# EAGLE design board (EAGLE 9.1.0)
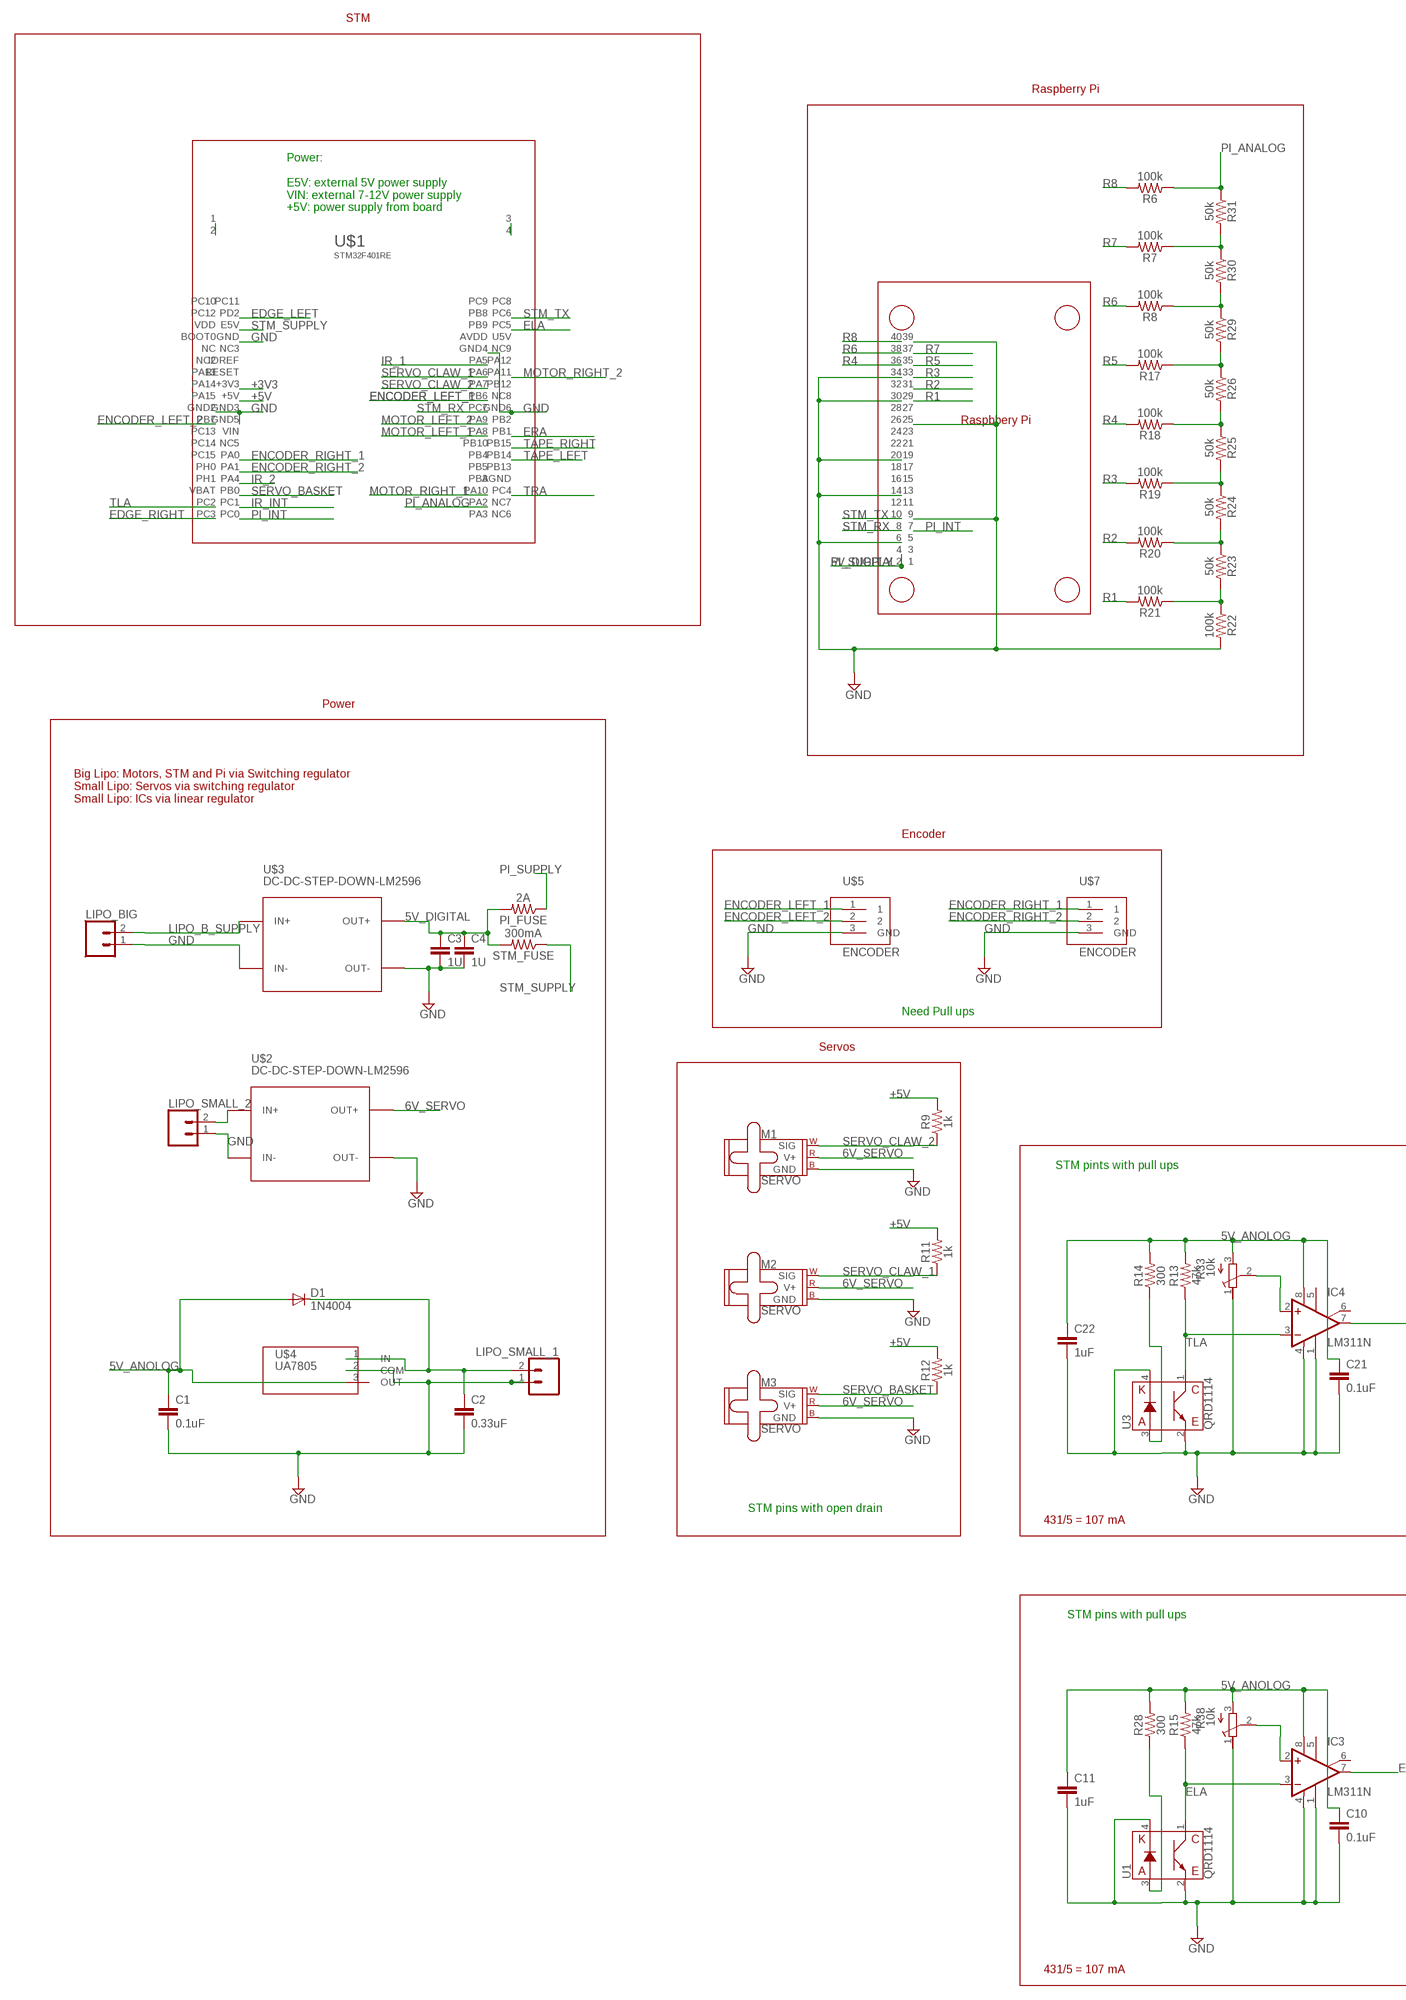
[diagram p0: schematic, sheet 1, part 1 of 2]
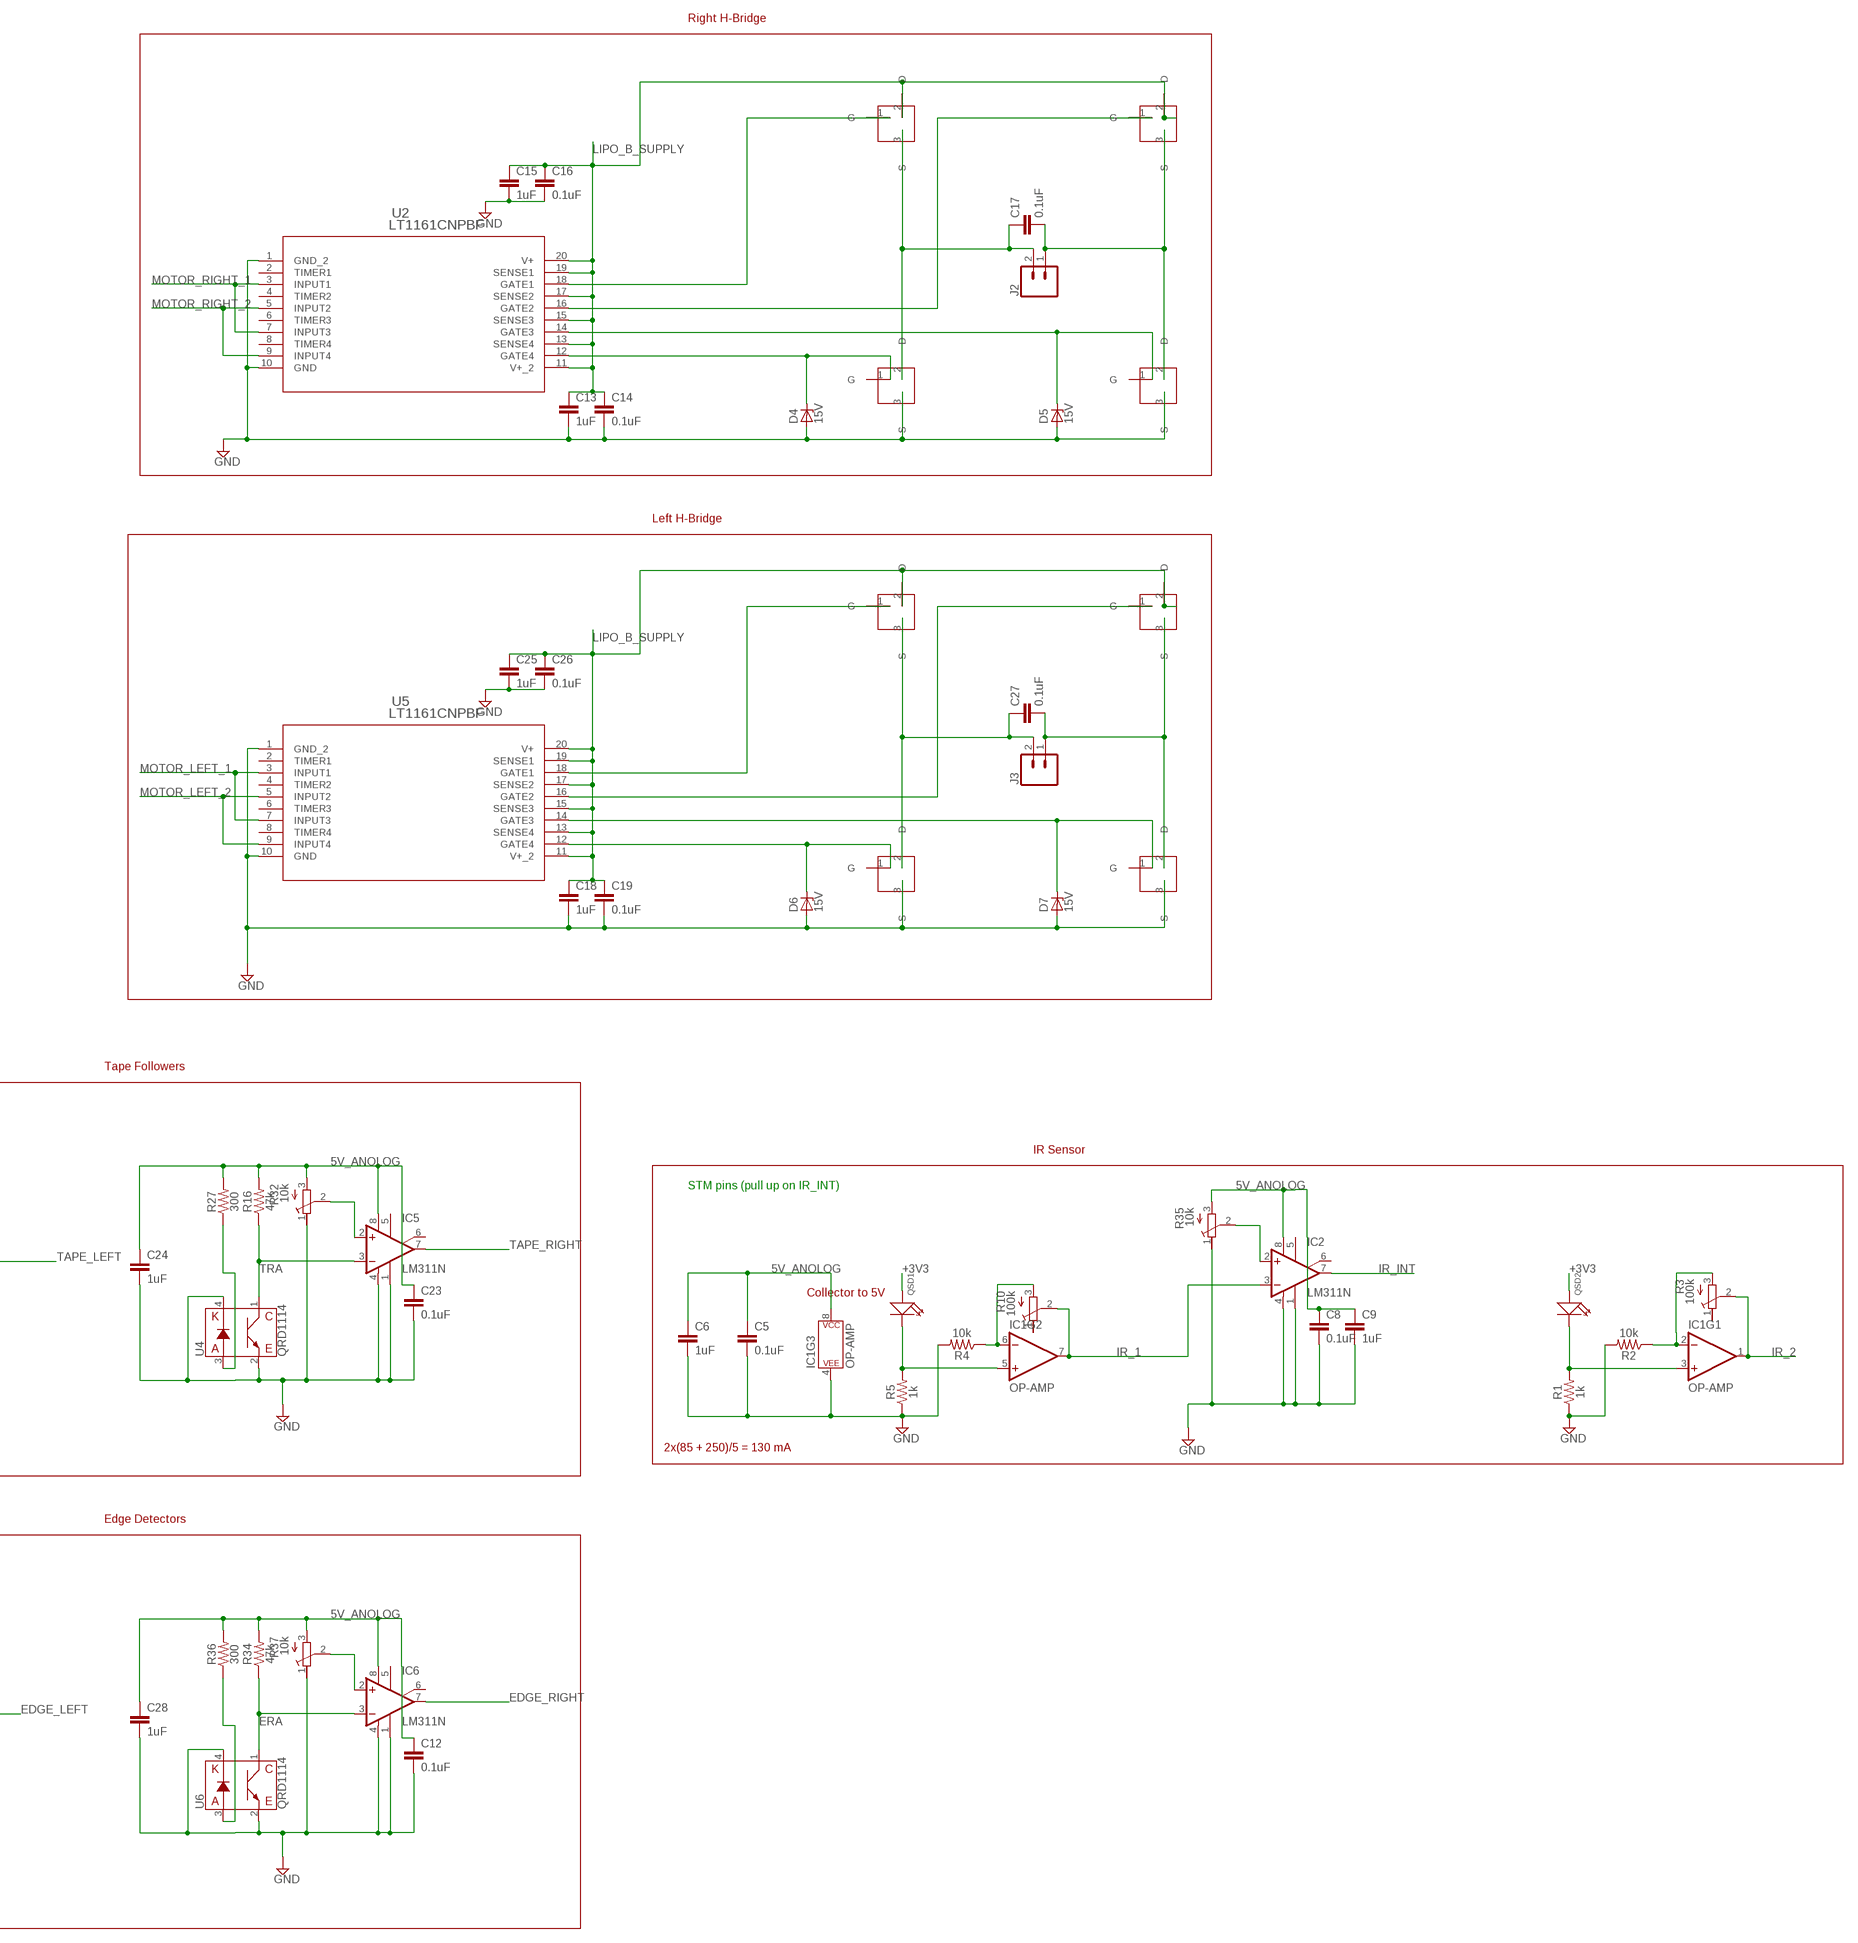
[diagram p1: schematic, sheet 1, part 2 of 2]

## Parts
C1  0.1uF  0.1UF-KIT-EZ-50V-20%  [CAP-PTH-SMALL-KIT]
C2  0.33uF  0.1UF-KIT-EZ-50V-20%  [CAP-PTH-SMALL-KIT]
C3  1U  C5/5  [C5B5]
C4  1U  C5/5  [C5B5]
C5  0.1uF  0.1UF-KIT-EZ-50V-20%  [CAP-PTH-SMALL-KIT]
C6  1uF  0.1UF-KIT-EZ-50V-20%  [CAP-PTH-SMALL-KIT]
C8  0.1uF  0.1UF-KIT-EZ-50V-20%  [CAP-PTH-SMALL-KIT]
C9  1uF  0.1UF-KIT-EZ-50V-20%  [CAP-PTH-SMALL-KIT]
C10  0.1uF  0.1UF-KIT-EZ-50V-20%  [CAP-PTH-SMALL-KIT]
C11  1uF  0.1UF-KIT-EZ-50V-20%  [CAP-PTH-SMALL-KIT]
C12  0.1uF  0.1UF-KIT-EZ-50V-20%  [CAP-PTH-SMALL-KIT]
C13  1uF  0.1UF-KIT-EZ-50V-20%  [CAP-PTH-SMALL-KIT]
C14  0.1uF  0.1UF-KIT-EZ-50V-20%  [CAP-PTH-SMALL-KIT]
C15  1uF  0.1UF-KIT-EZ-50V-20%  [CAP-PTH-SMALL-KIT]
C16  0.1uF  0.1UF-KIT-EZ-50V-20%  [CAP-PTH-SMALL-KIT]
C17  0.1uF  0.1UF-KIT-EZ-50V-20%  [CAP-PTH-SMALL-KIT]
C18  1uF  0.1UF-KIT-EZ-50V-20%  [CAP-PTH-SMALL-KIT]
C19  0.1uF  0.1UF-KIT-EZ-50V-20%  [CAP-PTH-SMALL-KIT]
C21  0.1uF  0.1UF-KIT-EZ-50V-20%  [CAP-PTH-SMALL-KIT]
C22  1uF  0.1UF-KIT-EZ-50V-20%  [CAP-PTH-SMALL-KIT]
C23  0.1uF  0.1UF-KIT-EZ-50V-20%  [CAP-PTH-SMALL-KIT]
C24  1uF  0.1UF-KIT-EZ-50V-20%  [CAP-PTH-SMALL-KIT]
C25  1uF  0.1UF-KIT-EZ-50V-20%  [CAP-PTH-SMALL-KIT]
C26  0.1uF  0.1UF-KIT-EZ-50V-20%  [CAP-PTH-SMALL-KIT]
C27  0.1uF  0.1UF-KIT-EZ-50V-20%  [CAP-PTH-SMALL-KIT]
C28  1uF  0.1UF-KIT-EZ-50V-20%  [CAP-PTH-SMALL-KIT]
D1  1N4004  [DO41-10]
D4  15V  ZENER-DIODEDO41Z10  [DO41Z10]
D5  15V  ZENER-DIODEDO41Z10  [DO41Z10]
D6  15V  ZENER-DIODEDO41Z10  [DO41Z10]
D7  15V  ZENER-DIODEDO41Z10  [DO41Z10]
IC1  OP-AMP  OPAMP-DUALDIP  [DIP08]
IC2  LM311N  [DIL08]
IC3  LM311N  [DIL08]
IC4  LM311N  [DIL08]
IC5  LM311N  [DIL08]
IC6  LM311N  [DIL08]
J2  CONN_02  [1X02]
J3  CONN_02  [1X02]
LIPO_BIG  CONN_02  [1X02]
LIPO_SMALL_1  CONN_02  [1X02]
LIPO_SMALL_2  CONN_02  [1X02]
M1  SERVO  [1X03]
M2  SERVO  [1X03]
M3  SERVO  [1X03]
PI_FUSE  2A  1KOHM-HORIZ-1/4W-5%  [AXIAL-0.3]
QSD1  DIP-LED-GREEN-GREEN(2P-D5MM)  [LED2-2.54-D5.0MM]
QSD2  DIP-LED-GREEN-GREEN(2P-D5MM)  [LED2-2.54-D5.0MM]
R1  1k  1KOHM-HORIZ-1/4W-5%  [AXIAL-0.3]
R2  10k  10KOHM-HORIZ-1/4W-1%  [AXIAL-0.3]
R3  100k  R-TRIMMT93YA  [RTRIMT93YA]
R4  10k  10KOHM-HORIZ-1/4W-1%  [AXIAL-0.3]
R5  1k  1KOHM-HORIZ-1/4W-5%  [AXIAL-0.3]
R6  100k  1KOHM-HORIZ-1/4W-1%  [AXIAL-0.3]
R7  100k  1KOHM-HORIZ-1/4W-1%  [AXIAL-0.3]
R8  100k  1KOHM-HORIZ-1/4W-1%  [AXIAL-0.3]
R9  1k  1KOHM-HORIZ-1/4W-5%  [AXIAL-0.3]
R10  100k  R-TRIMMT93YA  [RTRIMT93YA]
R11  1k  1KOHM-HORIZ-1/4W-5%  [AXIAL-0.3]
R12  1k  1KOHM-HORIZ-1/4W-5%  [AXIAL-0.3]
R13  47k  1KOHM-HORIZ-1/4W-1%  [AXIAL-0.3]
R14  300  1KOHM-HORIZ-1/4W-1%  [AXIAL-0.3]
R15  47k  1KOHM-HORIZ-1/4W-1%  [AXIAL-0.3]
R16  47k  1KOHM-HORIZ-1/4W-1%  [AXIAL-0.3]
R17  100k  1KOHM-HORIZ-1/4W-1%  [AXIAL-0.3]
R18  100k  1KOHM-HORIZ-1/4W-1%  [AXIAL-0.3]
R19  100k  1KOHM-HORIZ-1/4W-1%  [AXIAL-0.3]
R20  100k  1KOHM-HORIZ-1/4W-1%  [AXIAL-0.3]
R21  100k  1KOHM-HORIZ-1/4W-1%  [AXIAL-0.3]
R22  100k  1KOHM-HORIZ-1/4W-1%  [AXIAL-0.3]
R23  50k  1KOHM-HORIZ-1/4W-1%  [AXIAL-0.3]
R24  50k  1KOHM-HORIZ-1/4W-1%  [AXIAL-0.3]
R25  50k  1KOHM-HORIZ-1/4W-1%  [AXIAL-0.3]
R26  50k  1KOHM-HORIZ-1/4W-1%  [AXIAL-0.3]
R27  300  1KOHM-HORIZ-1/4W-1%  [AXIAL-0.3]
R28  300  1KOHM-HORIZ-1/4W-1%  [AXIAL-0.3]
R29  50k  1KOHM-HORIZ-1/4W-1%  [AXIAL-0.3]
R30  50k  1KOHM-HORIZ-1/4W-1%  [AXIAL-0.3]
R31  50k  1KOHM-HORIZ-1/4W-1%  [AXIAL-0.3]
R32  10k  R-TRIMMT93YA  [RTRIMT93YA]
R33  10k  R-TRIMMT93YA  [RTRIMT93YA]
R34  47k  1KOHM-HORIZ-1/4W-1%  [AXIAL-0.3]
R35  10k  R-TRIMMT93YA  [RTRIMT93YA]
R36  300  1KOHM-HORIZ-1/4W-1%  [AXIAL-0.3]
R37  10k  R-TRIMMT93YA  [RTRIMT93YA]
R38  10k  R-TRIMMT93YA  [RTRIMT93YA]
STM_FUSE  300mA  1KOHM-HORIZ-1/4W-5%  [AXIAL-0.3]
U1  QRD1114  [QRD1114]
U2  LT1161CNPBF  [PDIP-20_N]
U3  QRD1114  [QRD1114]
U4  QRD1114  [QRD1114]
U5  LT1161CNPBF  [PDIP-20_N]
U6  QRD1114  [QRD1114]
U$1  STM32F401RE  [STM32]
U$2  DC-DC-STEP-DOWN-LM2596  [DC-DC-STEP-DOWN-LM2596]
U$3  DC-DC-STEP-DOWN-LM2596  [DC-DC-STEP-DOWN-LM2596]
U$4  UA7805  [TO-220AB]
U$5  ENCODER  [TO-220AB]
U$6  RPI3  [PI]
U$7  ENCODER  [TO-220AB]
U$11  HUF75321  [TO-220AB]
U$12  HUF75321  [TO-220AB]
U$13  HUF75321  [TO-220AB]
U$14  HUF75321  [TO-220AB]
U$15  HUF75321  [TO-220AB]
U$16  HUF75321  [TO-220AB]
U$17  HUF75321  [TO-220AB]
U$18  HUF75321  [TO-220AB]

## Nets
5V_ANOLOG: C1.1 C5.1 C6.1 C8.1 C9.1 C10.1 C11.1 C12.1 C21.1 C22.1 C23.1 C24.1 C28.1 D1.A IC1.8(P$V+) IC2.8(V+) IC3.8(V+) IC4.8(V+) IC5.8(V+) IC6.8(V+) R13.P$2 R14.P$2 R15.P$2 R16.P$2 R27.P$2 R28.P$2 R32.3(A) R33.3(A) R34.P$2 R35.3(A) R36.P$2 R37.3(A) R38.3(A) U$4.3(OUT)
5V_DIGITAL: C3.1 C4.1 PI_FUSE.P$2 STM_FUSE.P$2 U$3.OUT+ U$6.2 U$6.4
6V_SERVO: M1.2(V+) M2.2(V+) M3.2(V+) U$2.OUT+
+3V3: QSD1.+ QSD2.+ U$1.+3V3
+5V: R9.P$2 R11.P$2 R12.P$2 U$1.+5V
EDGE_LEFT: IC3.7(OUT) U$1.PD2
EDGE_RIGHT: IC6.7(OUT) U$1.PC3
ELA: IC3.3(-IN) R15.P$1 U1.1(C) U$1.PC5
ENCODER_LEFT_1: U$1.PB6 U$5.1
ENCODER_LEFT_2: U$1.PB7 U$5.2
ENCODER_RIGHT_1: U$1.PA0 U$7.1
ENCODER_RIGHT_2: U$1.PA1 U$7.2
ERA: IC6.3(-IN) R34.P$1 U6.1(C) U$1.PB1
GND: C1.2 C2.2 C3.2 C4.2 C5.2 C6.2 C8.2 C9.2 C10.2 C11.2 C12.2 C13.2 C14.2 C15.2 C16.2 C18.2 C19.2 C21.2 C22.2 C23.2 C24.2 C25.2 C26.2 C28.2 D4.A D5.A D6.A D7.A IC1.4(P$V-) IC2.1(GND) IC2.4(V-) IC3.1(GND) IC3.4(V-) IC4.1(GND) IC4.4(V-) IC5.1(GND) IC5.4(V-) IC6.1(GND) IC6.4(V-) LIPO_BIG.1 LIPO_SMALL_1.1 LIPO_SMALL_2.1 M1.3(GND) M2.3(GND) M3.3(GND) R1.P$1 R2.P$2 R4.P$2 R5.P$1 R22.P$2 R32.1(E) R33.1(E) R35.1(E) R37.1(E) R38.1(E) U1.2(E) U1.4(K) U2.1(GND_2) U2.10(GND) U3.2(E) U3.4(K) U4.2(E) U4.4(K) U5.1(GND_2) U5.10(GND) U6.2(E) U6.4(K) U$1.GND U$1.GND2 U$1.GND3 U$1.GND4 U$1.GND5 U$1.GND6 U$2.IN- U$2.OUT- U$3.IN- U$3.OUT- U$4.2(COM) U$5.3(GND) U$6.6 U$6.9 U$6.14 U$6.20 U$6.25 U$6.30 U$6.34 U$6.39 U$7.3(GND) U$13.3(S) U$14.3(S) U$17.3(S) U$18.3(S)
IR_1: IC1.7(OUT) IC2.3(-IN) R10.2(S) U$1.PA5
IR_2: IC1.1(OUT) R3.2(S) U$1.PA4
IR_INT: IC2.7(OUT) U$1.PC1
LIPO_B_SUPPLY: C13.1 C14.1 C15.1 C16.1 C18.1 C19.1 C25.1 C26.1 LIPO_BIG.2 U2.11(V+_2) U2.13(SENSE4) U2.15(SENSE3) U2.17(SENSE2) U2.19(SENSE1) U2.20(V+) U5.11(V+_2) U5.13(SENSE4) U5.15(SENSE3) U5.17(SENSE2) U5.19(SENSE1) U5.20(V+) U$3.IN+ U$11.2(D) U$12.2(D) U$15.2(D) U$16.2(D)
MOTOR_LEFT_1: U5.3(INPUT1) U5.7(INPUT3) U$1.PA8
MOTOR_LEFT_2: U5.5(INPUT2) U5.9(INPUT4) U$1.PA9
MOTOR_RIGHT_1: U2.3(INPUT1) U2.7(INPUT3) U$1.PA10
MOTOR_RIGHT_2: U2.5(INPUT2) U2.9(INPUT4) U$1.PA11
N$1: LIPO_SMALL_2.2 U$2.IN+
N$2: IC1.2(-IN) R2.P$1 R3.3(A)
N$3: R28.P$1 U1.3(A)
N$4: IC1.6(-IN) R4.P$1 R10.3(A)
N$5: R21.P$1 R22.P$1 R23.P$2
N$6: IC5.2(+IN) R32.2(S)
N$7: R20.P$1 R23.P$1 R24.P$2
N$8: R19.P$1 R24.P$1 R25.P$2
N$9: R18.P$1 R25.P$1 R26.P$2
N$10: R17.P$1 R26.P$1 R29.P$2
N$11: R8.P$1 R29.P$1 R30.P$2
N$12: R7.P$1 R30.P$1 R31.P$2
N$13: IC2.2(+IN) R35.2(S)
N$15: IC3.2(+IN) R38.2(S)
N$16: R14.P$1 U3.3(A)
N$17: R36.P$1 U6.3(A)
N$19: IC6.2(+IN) R37.2(S)
N$20: U2.18(GATE1) U$11.1(G)
N$21: U2.16(GATE2) U$12.1(G)
N$22: D5.C U2.14(GATE3) U$14.1(G)
N$23: D4.C U2.12(GATE4) U$13.1(G)
N$24: C17.2 J2.1 U$12.3(S) U$14.2(D)
N$25: C17.1 J2.2 U$11.3(S) U$13.2(D)
N$26: U5.18(GATE1) U$15.1(G)
N$27: U5.16(GATE2) U$16.1(G)
N$29: IC4.2(+IN) R33.2(S)
N$30: R27.P$1 U4.3(A)
N$32: U$1.1 U$1.2
N$33: D7.C U5.14(GATE3) U$18.1(G)
N$34: D6.C U5.12(GATE4) U$17.1(G)
N$35: C27.2 J3.1 U$16.3(S) U$18.2(D)
N$36: C27.1 J3.2 U$15.3(S) U$17.2(D)
N$37: U$1.3 U$1.4
OUTPUT1: IC1.5(+IN) QSD1.- R5.P$2
OUTPUT2: IC1.3(+IN) QSD2.- R1.P$2
PI_ANALOG: R6.P$1 R31.P$1 U$1.PA2
PI_INT: U$1.PC0 U$6.7
PI_SUPPLY: PI_FUSE.P$1 U$6.2 U$6.4
R1: R21.P$2 U$6.29
R2: R20.P$2 U$6.31
R3: R19.P$2 U$6.33
R4: R18.P$2 U$6.36
R5: R17.P$2 U$6.35
R6: R8.P$2 U$6.38
R7: R7.P$2 U$6.37
R8: R6.P$2 U$6.40
SERVO_BASKET: M3.1(SIG) R12.P$1 U$1.PB0
SERVO_CLAW_1: M2.1(SIG) R11.P$1 U$1.PA6
SERVO_CLAW_2: M1.1(SIG) R9.P$1 U$1.PA7
STM_RX: U$1.PC7 U$6.8
STM_SUPPLY: STM_FUSE.P$1 U$1.E5V
STM_TX: U$1.PC6 U$6.10
TAPE_LEFT: IC4.7(OUT) U$1.PB14
TAPE_RIGHT: IC5.7(OUT) U$1.PB15
TLA: IC4.3(-IN) R13.P$1 U3.1(C) U$1.PC2
TRA: IC5.3(-IN) R16.P$1 U4.1(C) U$1.PC4
V_IN1: C2.1 D1.C LIPO_SMALL_1.2 U$4.1(IN)
Unconnected: IC2.5(ON) IC2.6(ON/STR) IC3.5(ON) IC3.6(ON/STR) IC4.5(ON) IC4.6(ON/STR) IC5.5(ON) IC5.6(ON/STR) IC6.5(ON) IC6.6(ON/STR) R3.1(E) R10.1(E) U2.2(TIMER1) U2.4(TIMER2) U2.6(TIMER3) U2.8(TIMER4) U5.2(TIMER1) U5.4(TIMER2) U5.6(TIMER3) U5.8(TIMER4) U$1.AGND U$1.AVDD U$1.BOOT0 U$1.IOREF U$1.NC U$1.NC2 U$1.NC3 U$1.NC5 U$1.NC6 U$1.NC7 U$1.NC8 U$1.NC9 U$1.PA3 U$1.PA12 U$1.PA13 U$1.PA14 U$1.PA15 U$1.PB2 U$1.PB3 U$1.PB4 U$1.PB5 U$1.PB8 U$1.PB9 U$1.PB10 U$1.PB12 U$1.PB13 U$1.PC8 U$1.PC9 U$1.PC10 U$1.PC11 U$1.PC12 U$1.PC13 U$1.PC14 U$1.PC15 U$1.PH0 U$1.PH1 U$1.RESET U$1.U5V U$1.VBAT U$1.VDD U$1.VIN U$6.1 U$6.3 U$6.5 U$6.11 U$6.12 U$6.13 U$6.15 U$6.16 U$6.17 U$6.18 U$6.19 U$6.21 U$6.22 U$6.23 U$6.24 U$6.26 U$6.27 U$6.28 U$6.32

## Notes on the sheet
- STM
- Raspberry Pi | Right H-Bridge
- Power:
  
  E5V: external 5V power supply
  VIN: external 7-12V power supply
  +5V: power supply from board
- Left H-Bridge
- Power
- Big Lipo: Motors, STM and Pi via Switching regulator
  Small Lipo: Servos via switching regulator
  Small Lipo: ICs via linear regulator
- Encoder
- Need Pull ups
- Servos
- Tape Followers
- STM pints with pull ups
- IR Sensor
- STM pins (pull up on IR_INT)
- Collector to 5V
- STM pins with open drain | 2x(85 + 250)/5 = 130 mA
- 431/5 = 107 mA
- Edge Detectors
- STM pins with pull ups
- 431/5 = 107 mA

## Library data of the parts
C1 C5 C8 C10 C12 C14 C16 C17 C19 C21 C23 C26 C27 = SparkFun-Capacitors:0.1UF: 0.1µF ceramic capacitors A capacitor is a passive two-terminal electrical component used to store electrical energy temporarily in an electric field.; PROD_ID: CAP-08370
C2 C6 C9 C11 C13 C15 C18 C22 C24 C25 C28 = SparkFun-Capacitors:0.1UF: 0.1µF ceramic capacitors A capacitor is a passive two-terminal electrical component used to store electrical energy temporarily in an electric field.; PROD_ID: CAP-08370; VALUE: 0.1uF
C3 C4 = capacitor-wima:C: CAPACITOR naming: grid - package width
D1 = adafruit:1N4004: DIODE General purpose 1N400x type rectifier (With bigger pads) http://www.ladyada.net/library/pcb/eaglelibrary.html
D4-D7 = diode:ZENER-DIODE: Z-Diode
IC1 = SparkFun-IC-Amplifiers:OPAMP-DUAL: Generic op-amp footprint This component is for the standard 358 pinning of a dual op-amp From the LM358 datasheet: Pin 1: Output A Pin 2: Inverting Input A Pin 3: Non-Inverting Input A Pin 4: Gnd Pin 5: Non-Inverting Input B Pin 6: Inverting Input B Pin 7: Output B Pin 8: V+; PROD_ID: NA-XXXXX
IC2-IC6 = linear:LM311: COMPARATOR
J2 J3 LIPO_BIG LIPO_SMALL_1 LIPO_SMALL_2 = SparkFun-Connectors:CONN_02: Multi connection point. Often used as Generic Header-pin footprint for 0.1 inch spaced/style header connections On any of the 0.1 inch spaced packages, you can populate with these: Break Away Headers - Straight <https://www.sparkfun.com/products/116> (PRT-00116) Break Away Male Headers - Right Angle <https://www.sparkfun.com/products/553> (PRT-00553) Female Headers <https://www.sparkfun.com/products/115> (PRT-00115) Break Away Headers - Machine Pin <https://www.sparkfun.com/products/117> (PRT-00117) Break Away Female Headers - Swiss Machine Pin <https://www.sparkfun.com/products/743> (PRT-00743) For SCREWTERMINALS and SPRING TERMINALS visit here: Screw Terimnals on SparkFun.com <https://www.sparkfun.com/search/results?term=Screw+Terminals> (5mm/3.5mm/2.54mm spacing) This device is also useful as a general connection point to wire up your design to another part of your project. Our various solder wires solder well into these plated through hole pads. Hook-Up Wire - Assortment (Stranded, 22 AWG) <https://www.sparkfun.com/products/11375> (PRT-11375) Hook-Up Wire - Assortment (Solid Core, 22 AWG) <https://www.sparkfun.com/products/11367> (PRT-11367) View the entire wire category on our website here <https://www.sparkfun.com/categories/141> Special notes: Molex polarized connector foot print use with: PRT-08233 with associated crimp pins and housings. 2.54_SCREWTERM for use with PRT-10571. 3.5mm Screw Terminal footprints for PRT-08084 5mm Screw Terminal footprints for use with PRT-08432
M1-M3 = SparkFun-Electromechanical:SERVO: Servo Motor 3-pin connector for a standard servo motor (voltage supply, ground, and control signal.) SparkFun Products Servo - Generic (Sub-Micro Size) <https://www.sparkfun.com/products/9065> (ROB-09065) Servo - Generic High Torque Continuous Rotation (Standard Size) <https://www.sparkfun.com/products/9347> (ROB-09347) Servo - Generic High Torque (Standard Size) <https://www.sparkfun.com/products/11965> (ROB-11965)
PI_FUSE STM_FUSE = SparkFun-Resistors:1KOHM: 1kΩ resistor A resistor is a passive two-terminal electrical component that implements electrical resistance as a circuit element. Resistors act to reduce current flow, and, at the same time, act to lower voltage levels within circuits. - Wikipedia; PROD_ID: RES-08380; VALUE: 1k
QSD1 QSD2 = Seeed-LED:DIP-LED-GREEN-GREEN(2P-D5MM): 304090038; MPN: G502DC; VALUE: G502DC
R1 R5 R9 R11 R12 = SparkFun-Resistors:1KOHM: 1kΩ resistor A resistor is a passive two-terminal electrical component that implements electrical resistance as a circuit element. Resistors act to reduce current flow, and, at the same time, act to lower voltage levels within circuits. - Wikipedia; PROD_ID: RES-08380
R2 R4 = SparkFun-Resistors:10KOHM: 10kΩ resistor A resistor is a passive two-terminal electrical component that implements electrical resistance as a circuit element. Resistors act to reduce current flow, and, at the same time, act to lower voltage levels within circuits. - Wikipedia; PROD_ID: RES-12183
R3 R10 R32 R33 R35 R37 R38 = resistor:R-TRIMM: Trimm resistor
R6-R8 R13-R31 R34 R36 = SparkFun-Resistors:1KOHM: 1kΩ resistor A resistor is a passive two-terminal electrical component that implements electrical resistance as a circuit element. Resistors act to reduce current flow, and, at the same time, act to lower voltage levels within circuits. - Wikipedia; PROD_ID: RES-12182; VALUE: 1k
U1 U3 U4 U6 = SparkFun-Sensors:QRD1114: QRD1114 Reflective Proximity, Object Sensor This sensor uses an infrared emitted diode combined with an infrared phototransistor to detect the reflected infrared signal. Ideal for sensing black-to-white transitions or can be used to detect nearby objects (.5-1cm). Datasheet <http://www.sparkfun.com/datasheets/BOT/QRD1114.pdf> SparkFun Products Optical Detector / Phototransistor - QRD1114 <https://www.sparkfun.com/products/246> (SEN-00246); PROD_ID: IC-09032; SF_ID: SEN-00246
U2 U5 = LT1161NC:LT1161CNPBF; MANUFACTURER_PART_NUMBER: LT1161CN#PBF; VENDOR: Linear Technology
U$1 = stm32f401re:STM32F401RE
U$2 U$3 = diy-modules:DC-DC-STEP-DOWN-LM2596: DC/DC Step-Down Regulator based on LM2596-ADJ chip LM2596 datasheet available here: http://www.ti.com/lit/ds/symlink/lm2596.pdf Click here to find device on ebay.com <http://www.ebay.com/sch/lm2596+power+regulator>
U$4 = TO220:UA7805
U$5 U$7 = TO220:ENCODER
U$6 = Raspberry_Pi_3:RPI3
U$11-U$18 = TO220:HUF75321

## Board
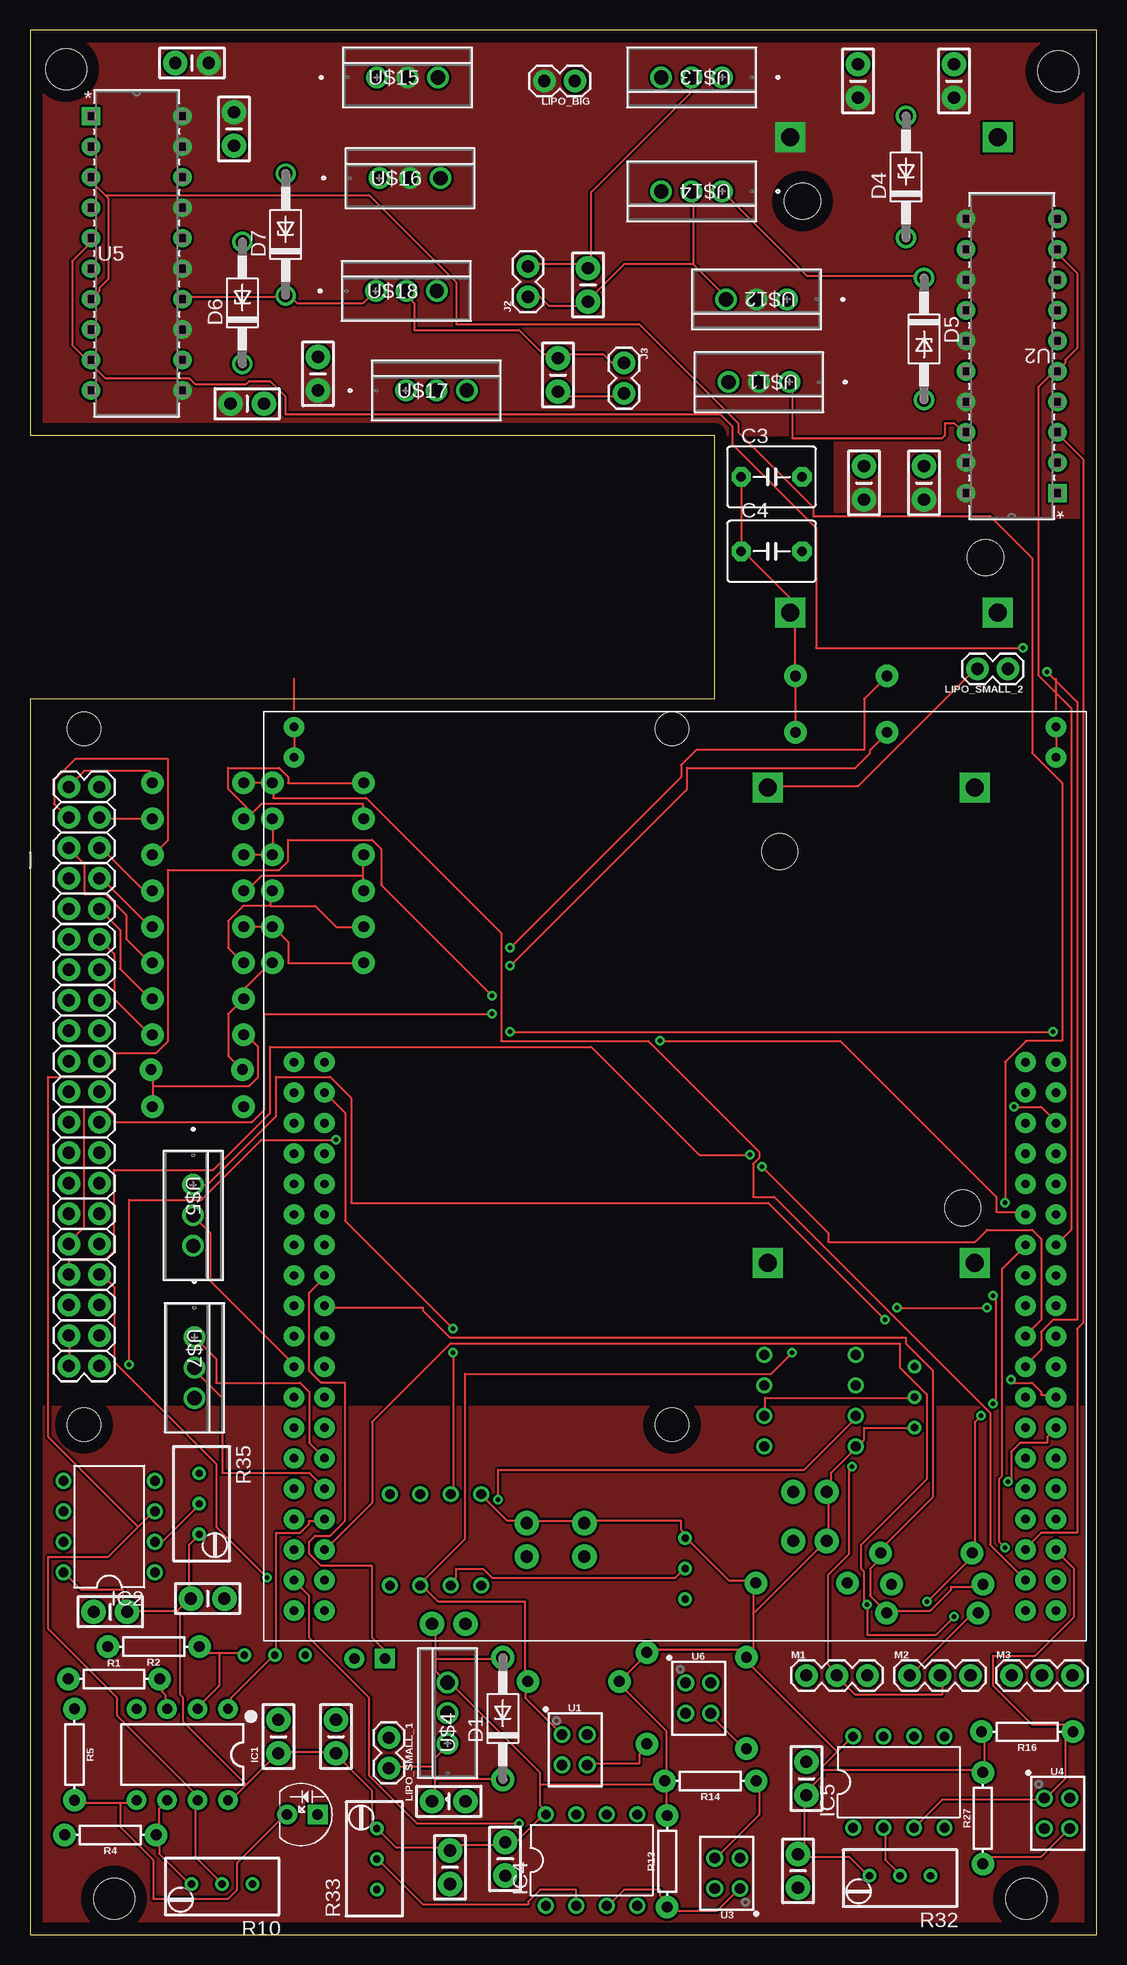
[diagram p2: board, top side]
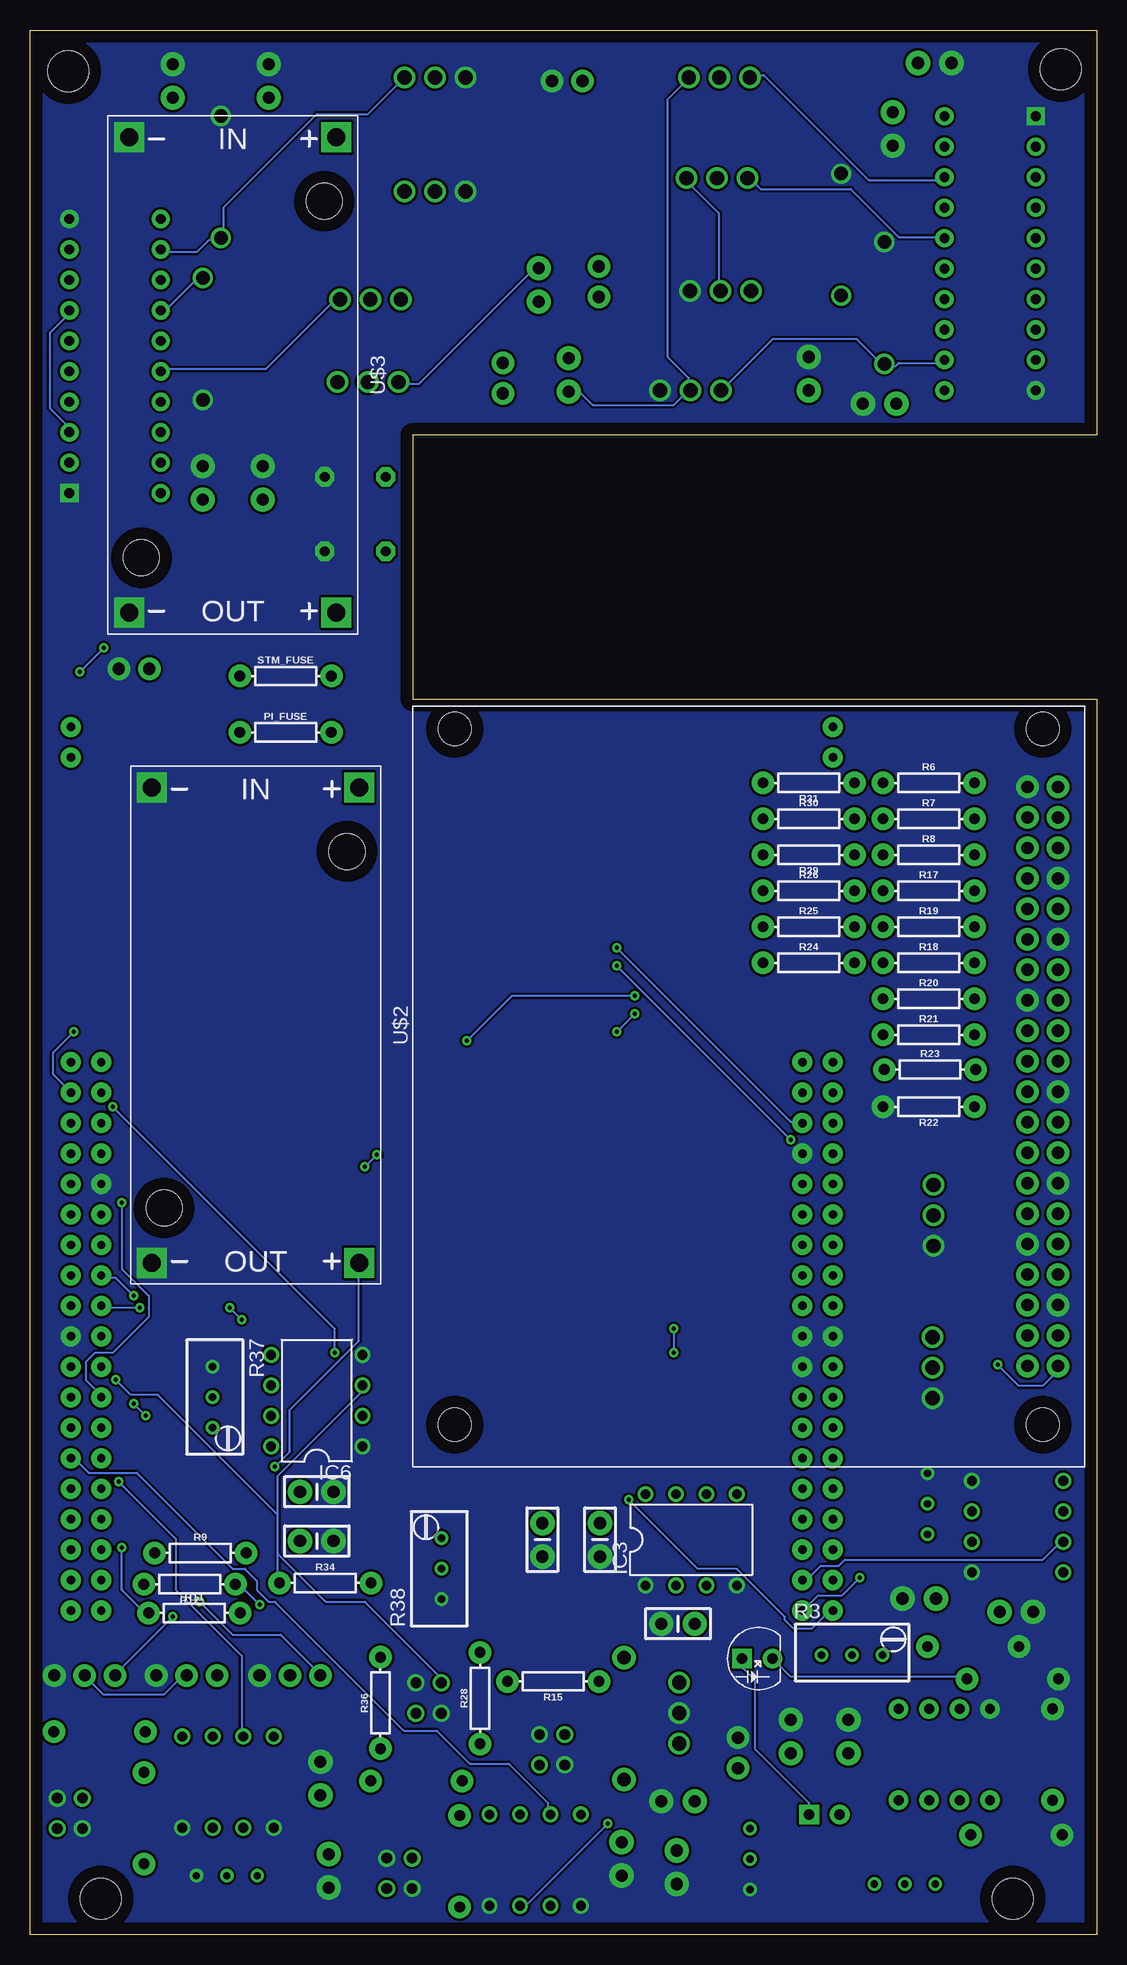
[diagram p3: board, bottom side, seen from below]

Size 88.9 x 158.75 mm. Coordinates in mm from the lower left corner, seen from the top.
Outline: 0,0 88.9,0 88.9,158.75 0,158.75 0,125 57,125 57,103 0,103 0,0
Copper layers (1*16): Top 0.05mm / dielectric 1.5mm / Bottom 0.05mm
Design rules "default *": minimum track width 6mil, minimum drill 0.35mm, track to track 8mil, track to pad 8mil, pad to pad 8mil, via to via 8mil, smd to smd 8mil, copper to edge 40mil, drill to drill 6mil, minimum pad ring 10mil, minimum via ring 8mil, stop-mask expansion 4mil, vias tented up to drill 0mil, thermal gap 10mil
Holes 3.4 mm at 3,155.5 85.7,155.3 83,3 7,3

### Footprints (pad centres in the part's own frame; a part is rotated, then mirrored left to right if it is on the bottom)
CAP-PTH-SMALL-KIT = drill 1.016 pad 2.032: 1 -1.397,0; 2 1.397,0
C5B5 = drill 0.813 pad 1.6 octagon: 1 -2.54,0; 2 2.54,0
DO41-10 = drill 1.118 pad 1.93: A 5.08,0; C -5.08,0
DO41Z10 = drill 1.118: A 5.08,0; C -5.08,0
DIP08 = drill 0.813 pad 1.626: 1 -3.81,-3.81; 2 -1.27,-3.81; 3 1.27,-3.81; 4 3.81,-3.81; 5 3.81,3.81; 6 1.27,3.81; 7 -1.27,3.81; 8 -3.81,3.81
DIL08 = drill 0.813 pad 1.27: 1 -3.81,-3.81; 2 -1.27,-3.81; 3 1.27,-3.81; 4 3.81,-3.81; 5 3.81,3.81; 6 1.27,3.81; 7 -1.27,3.81; 8 -3.81,3.81
1X02 = drill 1.016 pad 1.88: 1 0,0; 2 2.54,0
1X03 = drill 1.016 pad 1.88: 1 0,0; 2 2.54,0; 3 5.08,0
AXIAL-0.3 = drill 0.9 pad 1.88: P$1 -3.81,0; P$2 3.81,0
LED2-2.54-D5.0MM = drill 0.889 pad 1.651 square: + -1.27,0 | drill 0.889 pad 1.651: - 1.27,0
RTRIMT93YA = drill 0.61: 1 0,-2.54; 2 0,0; 3 0,2.54
QRD1114 = drill 0.9: 1 -1.067,1.27; 2 -1.067,-1.27; 3 1.041,-1.27; 4 1.041,1.27
PDIP-20_N = drill 0.813 pad 1.524 square: 1 -7.62,22.86 | drill 0.813 pad 1.524: 2 -7.62,20.32; 3 -7.62,17.78; 4 -7.62,15.24; 5 -7.62,12.7; 6 -7.62,10.16; 7 -7.62,7.62; 8 -7.62,5.08; 9 -7.62,2.54; 10 -7.62,0; 11 0,0; 12 0,2.54; 13 0,5.08; 14 0,7.62; 15 0,10.16; 16 0,12.7; 17 0,15.24; 18 0,17.78; 19 0,20.32; 20 0,22.86
STM32 = drill 0.7 pad 1.676: 1 0,73.66; 2 0,71.12; 3 63.5,73.66; 4 63.5,71.12; +3V3 2.54,27.94; +5V 2.54,25.4; AGND 63.5,7.62; AVDD 60.96,38.1; BOOT0 0,38.1; E5V 2.54,40.64; GND 2.54,38.1; GND2 0,22.86; GND3 2.54,22.86; GND4 60.96,35.56; GND5 2.54,20.32; GND6 63.5,22.86; IOREF 2.54,33.02; NC 0,35.56; NC2 0,33.02; NC3 2.54,35.56; NC5 2.54,15.24; NC6 63.5,0; NC7 63.5,2.54; NC8 63.5,25.4; NC9 63.5,35.56; PA0 2.54,12.7; PA1 2.54,10.16; PA2 60.96,2.54; PA3 60.96,0; PA4 2.54,7.62; PA5 60.96,33.02; PA6 60.96,30.48; PA7 60.96,27.94; PA8 60.96,17.78; PA9 60.96,20.32; PA10 60.96,5.08; PA11 63.5,30.48; PA12 63.5,33.02; PA13 0,30.48; PA14 0,27.94; PA15 0,25.4; PB0 2.54,5.08; PB1 63.5,17.78; PB2 63.5,20.32; PB3 60.96,7.62; PB4 60.96,12.7; PB5 60.96,10.16; PB6 60.96,25.4; PB7 0,20.32; PB8 60.96,43.18; PB9 60.96,40.64; PB10 60.96,15.24; PB12 63.5,27.94; PB13 63.5,10.16; PB14 63.5,12.7; PB15 63.5,15.24; PC0 2.54,0; PC1 2.54,2.54; PC2 0,2.54; PC3 0,0; PC4 63.5,5.08; PC5 63.5,40.64; PC6 63.5,43.18; PC7 60.96,22.86; PC8 63.5,45.72; PC9 60.96,45.72; PC10 0,45.72; PC11 2.54,45.72; PC12 0,43.18; PC13 0,17.78; PC14 0,15.24; PC15 0,12.7; PD2 2.54,43.18; PH0 0,10.16; PH1 0,7.62; RESET 2.54,30.48; U5V 63.5,38.1; VBAT 0,5.08; VDD 0,40.64; VIN 2.54,17.78
DC-DC-STEP-DOWN-LM2596 = drill 1.5 pad 2.5 square: IN+ -19.812,8.636; IN- -19.812,-8.636; OUT+ 19.812,8.636; OUT- 19.812,-8.636 | hole 3: -14.478,7.62; 15.24,-7.62
TO-220AB = drill 1.194 pad 1.702: 1 -5.08,0; 2 -2.54,0; 3 0,0
PI = drill 1.016 pad 1.88: 1 8.39,51.22; 2 8.39,53.76; 3 10.93,51.22; 4 10.93,53.76; 5 13.47,51.22; 6 13.47,53.76; 7 16.01,51.22; 8 16.01,53.76; 9 18.55,51.22; 10 18.55,53.76; 11 21.09,51.22; 12 21.09,53.76; 13 23.63,51.22; 14 23.63,53.76; 15 26.17,51.22; 16 26.17,53.76; 17 28.71,51.22; 18 28.71,53.76; 19 31.25,51.22; 20 31.25,53.76; 21 33.79,51.22; 22 33.79,53.76; 23 36.33,51.22; 24 36.33,53.76; 25 38.87,51.22; 26 38.87,53.76; 27 41.41,51.22; 28 41.41,53.76; 29 43.95,51.22; 30 43.95,53.76; 31 46.49,51.22; 32 46.49,53.76; 33 49.03,51.22; 34 49.03,53.76; 35 51.57,51.22; 36 51.57,53.76; 37 54.11,51.22; 38 54.11,53.76; 39 56.65,51.22; 40 56.65,53.76 | hole 2.75: 3.5,52.5; 3.5,3.5; 61.5,3.5; 61.5,52.5

### Placement (x,y rotation side)
C1  64,5.3 270 top
C2  34.9,11.1 0 top
C3  61.8,121.5 0 top
C4  61.8,115.3 0 top
C5  64.7,13 90 top
C6  20.7,16.5 90 top
C8  14.8,28 0 top
C9  6.7,26.9 180 top
C10  46.2,32.9 270 bottom
C11  41.4,32.9 270 bottom
C12  65,36.9 0 bottom
C13  74.5,121 90 top
C14  69.5,121 90 top
C15  77,154.5 90 top
C16  69,154.5 90 top
C17  46.5,137.5 270 top
C18  17,150.5 270 top
C19  13.5,156 180 top
C21  25.5,16.5 90 top
C22  39.6,6.3 270 top
C23  34.9,25.9 180 bottom
C24  35,5.6 270 top
C25  18.1,127.6 0 top
C26  24,130.1 90 top
C27  44,130 90 top
C28  65,32.8 0 bottom
D1  39.4,18 90 top
D4  73,146.5 90 top
D5  74.5,133 270 top
D6  17.7,136 90 top
D7  21.3,141.7 90 top
IC1  12.7,15 180 top
IC2  6.6,34 90 top
IC3  33.8,32.9 0 bottom
IC4  46.8,6.2 0 top
IC5  72.4,12.7 0 top
IC6  65,44.5 90 bottom
J2  41.5,136.5 90 top
J3  49.5,131 270 top
LIPO_BIG  45.4,154.5 180 top
LIPO_SMALL_1  29.9,16.4 270 top
LIPO_SMALL_2  81.5,105.5 180 top
M1  64.7,21.6 0 top
M2  73.3,21.6 0 top
M3  81.8,21.6 0 top
PI_FUSE  67.6,100.2 0 bottom
QSD1  22.7,10 180 top
QSD2  28.3,23 0 bottom
R1  7,21.3 0 top
R2  10.3,24 180 top
R3  20.4,23.3 270 bottom
R4  6.7,8.3 180 top
R5  3.7,15 270 top
R6  14,96 0 bottom
R7  14,93 0 bottom
R8  14,90 0 bottom
R9  74.7,31.8 0 bottom
R10  16,4.2 90 top
R11  75.2,26.8 0 bottom
R12  75.6,29.2 180 bottom
R13  53.1,6.1 90 top
R14  56.7,12.8 180 top
R15  45.3,21.1 180 bottom
R16  83.1,16.9 180 top
R17  14,87 0 bottom
R18  14,81 0 bottom
R19  14,84 0 bottom
R20  14,78 0 bottom
R21  14,75 0 bottom
R22  14,69 180 bottom
R23  13.9,72.1 0 bottom
R24  24,81 0 bottom
R25  24,84 0 bottom
R26  24,87 0 bottom
R27  79.4,9.7 90 top
R28  51.4,19.7 90 bottom
R29  24,90 180 bottom
R30  24,93 0 bottom
R31  24,96 180 bottom
R32  72.5,4.9 90 top
R33  28.9,6.3 0 top
R34  64.3,29.3 0 bottom
R35  14.1,35.9 180 top
R36  59.7,19.3 90 bottom
R37  73.7,44.8 180 bottom
R38  54.6,30.5 0 bottom
STM_FUSE  67.6,104.9 0 bottom
U1  45.4,15.4 0 top
U2  78,143 180 top
U3  58.1,5.1 180 top
U4  85.6,10.1 0 top
U5  12.7,128.7 0 top
U6  55.7,19.7 0 top
U$1  22,27 0 top
U$2  70.1,75.8 270 bottom
U$3  72,130 270 bottom
U$4  34.8,21 90 top
U$5  13.6,57.4 270 top
U$6  57,39 90 top
U$7  13.7,44.7 270 top
U$11  58.2,129.4 180 top
U$12  58,136.3 180 top
U$13  52.6,154.8 180 top
U$14  52.6,145.3 180 top
U$15  34,154.8 0 top
U$16  34.2,146.4 0 top
U$17  36.4,128.7 0 top
U$18  33.9,137 0 top

### Tracks (layer width: path | path; a pad name or v marks a point on that pad's centre or on a via)
5V_ANALOG
  pour Top (no thermals): 0,34 0,0 89,0 89,44 28,44 27,44 0,44
5V_ANOLOG
  Top 0.152: 13.25,28 13.25,32.5 14,33.25 R35.3 | 13.25,28 C8.1 13.25,28 | IC2.8 3,30 4.25,28.75 7.75,28.75 7.75,27.25 8,27 C9.1 8.25,27 12.25,27 | 12.25,27 13.25,28 | 18,12.5 20.5,15 C6.1 20.75,15.25 25.5,15.25 C21.1 25.5,15 28.5,12 28.5,9.5 28.75,9.25 28.75,9 R33.3 29,8.75 30.5,7.25 35,7.25 | 18,12.5 16.75,11.25 IC1.8 | 33.75,23 33.75,25.75 C23.1 | 33.75,23 33.75,22 34.75,21 U$4.3 35,21 42.5,13.5 42.5,12.5 | 33.75,23 39.25,23 D1.A | 35,7.25 C24.1 35,7.25 | 35,7.25 35,7.5 39.5,7.5 C22.1 39.75,7.75 40.5,7.75 42.75,10 IC4.8 42.75,10.25 42.75,10.5 42.5,10.75 42.5,12.5 | 12.25,27 12.5,26.75 12.5,20 12.75,19.75 12.75,17.75 18,12.5 | R32.3 69.75,5 68.25,6.5 64,6.5 C1.1 64,6.75 64.5,7.25 64.5,11.5 C5.1 64.75,11.75 64.75,12 66,13.25 66,13.75 | R16.P$2 79.5,16.75 79.5,13.75 R27.P$2 79.25,13.75 66,13.75 | 67.25,15.25 66,14 66,13.75 | 67.25,15.25 68.5,16.5 IC5.8 | R13.P$2 53,10 53,12.75 R14.P$2 | R14.P$2 53,13 53,17 49.25,20.75 49.25,21 R15.P$2 49.25,21.25 51.25,23.25 51.25,23.5 R28.P$2 51.5,23.75 59.5,23.75 59.5,23.25 R36.P$2 | R37.3 73.5,42.25 69.5,42.25 69.5,41.25 69,40.75 IC6.8 68.75,40.5 66.75,38.5 66.75,37.25 66.5,37 C12.1 66.5,36.75 66.5,33 C28.1 66.25,32.75 60.25,26.75 | IC3.8 37.75,36.5 39.75,34.5 41.25,34.5 C11.1 41.5,34.5 46,34.5 C10.1 46.25,34.5 54.25,34.5 54.25,33.75 54.5,33.5 54.5,33.25 R38.3 54.75,33 58.25,29.5 60.25,29.5 R34.P$2 60.25,29.25 60.25,26.75 | 60.25,26.75 60.25,23.75 59.75,23.25 R36.P$2 | 67.25,15.25 59.75,22.75 59.75,23 R36.P$2 | 42.5,12.5 52.75,12.5 52.75,12.75 R14.P$2
5V_DIGITAL
  Top 0.152: C3.1 59.25,115.5 C4.1 59.5,115.25 63.25,111.5 63.25,110.25 U$3.OUT+ 63.5,110 63.75,109.75 63.75,105 STM_FUSE.P$2 63.75,104.75 63.75,100.25 PI_FUSE.P$2
6V_SERVO  (via drill 0.35)
  Top 0.152: M2.2 76,21.5 76,20 68.75,20 67.25,21.5 M1.2 67,21.75 67,22 66.5,22.5 66.5,30 68.25,31.75 68.25,38.75 v68.5,39
  Bottom 0.152: M3.2 84.25,21.5 82.75,20 77.75,20 76,21.75 M2.2 | v68.5,39 67.25,40.25 67.25,43.75 61.5,49.5 61.5,55.75 U$2.OUT+
+3V3
  Top 0.152: U$1.+3V3 24.5,54.75 23.25,53.5 23.25,47 24.25,46 26.25,46 26.25,34.5 25,33.25 23.75,33.25 23.25,32.75 23.25,31.75 24.25,30.75 28.5,30.75 28.5,24.75 29.5,23.75 29.5,23 QSD2.+
  Bottom 0.152: QSD1.+ 24,10 24,11 28.5,15.5 28.5,21.25 29.5,22.25 29.5,23 QSD2.+
+5V
  Top 0.152: U$1.+5V 24.75,52.25 32.75,52.25 32.75,52 35,49.75 73,49.75 73,49.25 75.25,47 75.25,36.5 71,32.25 71,32 R9.P$2 70.75,31.75 70.75,31.25 70,30.5 70,28.25 71.25,27 R11.P$2 71.5,27 75,27 76.75,28.75 76.75,29 79.25,29 R12.P$2
EDGE_LEFT  (via drill 0.35)
  Top 0.152: v35.25,48.5 35.25,36.75 IC3.7 | v35.25,50.5 26.25,59.5 26.25,68.5 24.75,70 U$1.PD2
  Bottom 0.152: v35.25,50.5 v35.25,48.5
EDGE_RIGHT  (via drill 0.35)
  Top 0.152: v39,36.25 39,38.75 64.5,38.75 68.75,43 IC6.7
  Bottom 0.152: v39,36.25 33.25,30.5 30,30.5 26,26.5 26,26.25 25.25,25.5 23.75,25.5 22.25,27 U$1.PC3
ELA  (via drill 0.35)
  Top 0.152: U1.1 44.25,16.75 41.25,19.75 41.25,21 R15.P$1 41.25,21.25 41.25,27.75 34,27.75 32.75,29 IC3.3 32.75,29.25 32.75,29.5 36.25,33 36.25,46.75 61.75,46.75 v63.5,48.5 | v82,69 84.25,69 85.5,67.75 U$1.PC5
  Bottom 0.152: v82,69 63.5,50.5 v63.5,48.5
ENCODER_LEFT_1  (via drill 0.35)
  Top 0.152: v72.25,52.25 v79.75,52.25 | v71.25,51.25 61.5,61 26.75,61 26.75,69.75 25,71.5 20.5,71.5 20.5,68.25 14.75,62.5 13.75,62.5 U$5.1
  Bottom 0.152: v79.75,52.25 82.75,52.25 U$1.PB6 | v71.25,51.25 v72.25,52.25
ENCODER_LEFT_2
  Top 0.152: U$1.PB7 22,47.5 15,54.5 15,58.5 13.75,59.75 U$5.2
ENCODER_RIGHT_1
  Top 0.152: U$1.PA0 24.5,39.75 23.25,41 23.25,45.25 22.5,46 15.5,46 15.5,48 13.75,49.75 U$7.1
ENCODER_RIGHT_2
  Top 0.152: U$1.PA1 24.5,37.25 23.25,38.5 16,38.5 16,44.75 13.75,47 U$7.2
ERA  (via drill 0.35)
  Top 0.152: v81.75,46.25 81.75,46 83.5,46 84.25,45.25 84.25,45 85.5,45 U$1.PB1
  Bottom 0.152: 68.25,31.75 68.25,29.5 R34.P$1 | 68.25,31.75 68.25,35 | 68.25,35 68.25,38.25 61.25,45.25 61.25,45.75 IC6.3 | 68.25,31.75 64.25,27.75 61,27.75 54.75,21.5 54.75,21 U6.1 | v81.75,46.25 80.5,45 78.25,45 68.25,35
GND
  pour Bottom (no thermals): 0,158.75 0,125 57,125 57,103 0,103 0,0 88.9,0 88.9,158.75
IR_1  (via drill 0.35)
  Top 0.152: R10.2 16,4.25 13.75,6.5 13.75,11 IC1.7 13.75,11.25 13.75,11.75 7.25,18.25 7.25,19.75 1.5,25.5 1.5,31.5 6.5,31.5 9,34 | 9,34 10.25,35.25 IC2.3 | v52.5,74.5 67.5,74.5 80.5,61.5 80.5,60.25 82.75,60.25 U$1.PA5 | v38.5,78.25 29.25,87.5 29.25,90.5 28.5,91.25 21.5,91.25 21.5,89.5 20.75,88.75 11.5,88.75 11.5,74.5 10.5,73.5 7,73.5 7,72.25 6.25,71.5 1.5,71.5 1.5,41.5 9,34
  Bottom 0.152: v52.5,74.5 48.75,78.25 v38.5,78.25
IR_2
  Top 0.152: IC1.1 16.75,19 16.75,19.75 20.25,23.25 R3.2 20.5,23.5 20.5,33.5 22.5,33.5 23.25,34.25 23.25,34.5 24.5,34.5 U$1.PA4
IR_INT
  Bottom 0.152: IC2.7 3,32.5 3.25,32.5 4.5,31.25 21,31.25 21.5,30.75 23,30.75 24,29.75 24.5,29.75 U$1.PC1
LIPO_B_SUPPLY
  Top 0.152: 74.5,119.75 C13.1 74.5,119.75
  pour Top (no thermals): 0,158.75 0,125 67,125 67,118.11 88.9,118.11 88.9,158.75
MOTOR_LEFT_1  (via drill 0.35)
  Top 0.152: 6.25,145 5.25,146 5.25,146.25 U5.3 | 6.25,145 6.5,144.75 6.5,138 5.75,137.25 5.75,137 5.25,136.5 U5.7 | v81.25,61 81.25,72.75 83,74.5 86,74.5 86,96 83.5,98.5 83.5,114.75 80,118.25 65.25,118.25 65.25,119 59,125.25 59,126 50.75,134.25 35.5,134.25 35.5,137.75 28.25,145 6.25,145
  Bottom 0.152: v81.25,61 81.25,55.5 79,53.25 79,51.5 82,48.5 83.5,48.5 84.25,47.75 84.25,46.25 83,45 U$1.PA8
MOTOR_LEFT_2  (via drill 0.35)
  Top 0.152: U5.5 5,141.25 5,141 3.5,139.5 3.5,132.5 4.5,131.5 4.5,131.25 5,131.25 U5.9 5.25,131 5.25,130.75 6.25,129.75 13.25,129.75 13.75,129.25 18,129.25 18.25,129.5 20,129.5 21.25,128.25 21.25,126.75 57.5,126.75 58.5,125.75 58.5,124.25 65.5,117.25 65.5,107.25 v82.75,107.25 | v84.75,105.25 87.25,102.75 87.25,51.25 85.25,51.25 84.25,50.25 84.25,48.75 83,47.5 U$1.PA9
  Bottom 0.152: v82.75,107.25 v84.75,105.25
MOTOR_RIGHT_1
  Top 0.152: U$1.PA10 83,32.25 84.25,33.5 87.25,33.5 87.25,50.5 87.75,51 87.75,123 85.75,125 U2.3
  Bottom 0.152: U2.3 85.75,125.25 85.75,125.75 87.25,127.25 87.25,133.5 85.5,135.25 U2.7
MOTOR_RIGHT_2
  Top 0.152: U2.9 85.75,140.25 85.75,140 87.25,138.5 87.25,132.25 86.25,131.25 86.25,131 85.75,130.5 U2.5 85.5,130.5 84,129 84,105 86.75,102.25 86.75,58.75 85.5,57.5 U$1.PA11
N$1
  Top 0.152: LIPO_SMALL_2.2 78.75,105.5 69,95.75 61.5,95.75 U$2.IN+
N$2
  Top 0.152: 15.75,23.5 14.25,23.5 14.25,24 R2.P$1 | 15.75,23.5 17.75,23.5 R3.3 | 15.75,23.5 15.75,20.75 14,19 IC1.2
N$3
  Top 0.152: U1.3 46.5,14.25 50.75,14.25 50.75,15 51.25,15.5 51.25,15.75 R28.P$1
N$4
  Top 0.152: R10.3 13.25,4.25 10.75,6.75 10.75,8.25 R4.P$1 10.75,8.5 10.75,10.5 11.25,11 IC1.6
N$5
  Top 0.152: 10.25,70.75 10.25,69 R22.P$1 | 10.25,70.75 10.25,72 R23.P$2 | 10.25,70.75 18.25,70.75 19,71.5 19,74 18,75 R21.P$1
N$6
  Top 0.152: R32.2 72.5,5 71.25,6.25 71.25,8.75 IC5.2
N$7
  Top 0.152: R23.P$1 17.5,72.25 16.5,73.25 16.5,76.75 17.75,78 R20.P$1 18,78 18,79 20,81 R24.P$2
N$8
  Top 0.152: R19.P$1 18,84 20,84 R25.P$2 20.25,84 21.5,82.75 21.5,81 27.75,81 R24.P$1
N$9
  Top 0.152: 20,85.75 17.75,85.75 16.5,84.5 16.5,82.25 17.75,81 R18.P$1 | 20,85.75 20,87 R26.P$2 | 20,85.75 23.75,85.75 25.5,84 27.75,84 R25.P$1
N$10
  Top 0.152: 27.75,88.25 19.25,88.25 18,87 R17.P$1 | 27.75,88.25 27.75,87 R26.P$1 | 27.75,88.25 27.75,90 R29.P$2
N$11
  Top 0.152: R8.P$1 18,90 20,90 R29.P$1 20.25,90 20.25,93 R30.P$2
N$12
  Top 0.152: 18.5,93.5 19.25,94.25 27.75,94.25 27.75,93 R30.P$1 | 18.5,93.5 18,93 R7.P$1 18.5,93.5 | 18.5,93.5 16.5,95.5 16.5,97.25 20.75,97.25 21.5,96.5 21.5,96 27.75,96 R31.P$2
N$13
  Top 0.152: R35.2 14,35.75 11,32.75 10.5,32.75 IC2.2
N$15
  Top 0.152: R38.2 54.5,30.5 53.75,29.75 38.5,29.75 37.75,30.5 35.5,30.5 35.5,29.75 35.25,29.5 35.25,29.25 IC3.2
N$16
  Top 0.152: U3.3 57.25,6.5 60.75,10 60.75,12.75 R14.P$1
N$17
  Top 0.152: U6.3 56.75,18.25 59.5,15.5 R36.P$1
N$19
  Top 0.152: R37.2 73.5,44.75 61.25,44.75 61.25,43.25 IC6.2
N$20
  Top 0.152: U2.18 78,125.25 77.5,125.25 77.5,125.5 77,126 76.25,126 76.25,125 76,124.75 63.5,124.75 63.5,129.25 U$11.1
N$21
  Bottom 0.152: U2.16 78,130.5 69.25,130.5 63.25,136.5 U$12.1
N$22
  Top 0.152: U$14.1 57.75,145.25 64.75,138.25 74.5,138.25 D5.C
  Bottom 0.152: U2.14 78,135.5 77.5,135.5 75,138 74.5,138 D5.C
N$23
  Bottom 0.152: U2.12 78,140.25 75,140.25 74,141.25 73,141.25 D4.C 73,141.5 72.75,141.75 72.75,144 65,151.75 60.75,151.75 57.75,154.75 U$13.1
N$24
  Top 0.152: J2.1 42.5,136.5 43.25,135.75 46.5,135.75 46.5,136 C17.2 46.5,136.25 49.5,139.25 55.25,139.25 | 55.25,139.25 58,136.5 U$12.3 | 55.25,139.25 55.25,145.25 U$14.2
N$25
  Top 0.152: 46.75,139.25 46.75,145.25 55,153.5 55,154.75 U$13.2 | 46.75,139.25 46.5,139 C17.1 46.75,139.25 | 46.75,139.25 41.5,139.25 J2.2
  Bottom 0.152: U$11.3 58,129.25 56.5,129.25 47,138.75 46.5,138.75 C17.1
N$26
  Bottom 0.152: U5.18 12.75,146.25 19,146.25 27.75,155 28.75,155 U$15.1
N$27
  Bottom 0.152: U5.16 12.75,141.5 16.5,141.5 20.5,145.5 28,145.5 29,146.5 U$16.1
N$29
  Top 0.152: R33.2 29,6.25 32.75,2.5 41.5,2.5 41.5,2.75 42.5,3.75 45.5,3.75 45.5,2.5 IC4.2
N$30
  Top 0.152: U4.3 86.5,8.75 84.25,6.5 79.5,6.5 79.5,6 R27.P$1
N$32
  Top 0.152: U$1.2 22,98.25 22,100.5 U$1.1
N$32
  Top 0.152: 22,102.12 22,104.66
N$33
  Top 0.152: U5.14 12.75,136.5 21.25,136.5 D7.C 21.5,136.75 22.25,136 27.75,136 28.75,137 U$18.1
N$34
  Bottom 0.152: U5.12 12.75,131 16.5,131 16.75,130.75 17.5,130.75 D6.C 17.75,130.75 20,133 27,133 31.25,128.75 U$17.1
N$35
  Top 0.152: J3.1 48.5,131 47.75,131.75 44,131.75 | 44,131.75 44,131.5 C27.2 44,131.75 | 44,131.75 42.75,131.75 40.75,133.75 32,133.75 32,136 31.5,136.5 31.5,137 U$18.2
  Bottom 0.152: U$18.2 31.5,137 31.5,143.5 34.25,146.25 U$16.3
N$36
  Top 0.152: J3.2 49.5,128.25 44,128.25 44,128.5 C27.1
  Bottom 0.152: C27.1 44,128.5 43,128.5 42,127.5 35.25,127.5 34.25,128.5 34,128.5 U$17.2 34,128.75 34,129.75 35.75,131.5 35.75,153 34,154.75 U$15.3
N$37
  Top 0.152: U$1.4 85.5,98.25 85.5,100.5 U$1.3
N$37
  Top 0.152: 85.5,102.12 85.5,104.66
OUTPUT1
  Top 0.152: 7.5,11 3.75,11 R5.P$2 | 7.5,11 8.75,11 IC1.5 | 7.5,11 7.5,9 10.25,6.25 10.25,3 16.5,3 17.25,3.75 17.25,6 21.25,10 QSD1.-
OUTPUT2
  Top 0.152: IC1.3 11.25,19 11.25,20 11,20.25 11,21.25 R1.P$2
  Bottom 0.152: QSD2.- 27,23 25.5,21.5 11,21.5 R1.P$2
PI_ANALOG
  Top 0.152: U$1.PA2 82.75,29.75 80,32.5 80,43.5 62,61.5 60.25,61.5 60.25,64.25 60.75,64.75 60.75,65.25 51.5,74.5 39.25,74.5 39.25,83.5 28,94.75 20.25,94.75 20.25,96 R31.P$1 20,96 18,96 R6.P$1
PI_INT  (via drill 0.35)
  Top 0.152: v19.75,29.75 15.5,34 15.5,39.25 7,47.75 7,54 6,55 U$6.7
  Bottom 0.152: v19.75,29.75 21.25,28.25 23.25,28.25 24.5,27 U$1.PC0
PI_SUPPLY  (via drill 0.35)
  Top 0.152: U$6.2 3.25,47.5 3.25,49.75 U$6.4 | v40,80.75 54.75,95.5 54.75,97.25 68.75,97.25 70,98.5 70,98.75 71.25,100 PI_FUSE.P$1 | v25.5,66.25 19.25,66.25 14.25,61.25 8.25,61.25 v8.25,47.5
  Bottom 0.152: v25.5,66.25 v40,80.75 | v8.25,47.5 6.5,45.75 4.5,45.75 3,47.25 U$6.2
R1
  Top 0.152: R21.P$2 10,75 7,78 7,81.75 6,82.75 U$6.29
R2
  Top 0.152: R20.P$2 10,78 7.5,80.5 7.5,83.75 6,85.25 U$6.31
R3
  Top 0.152: U$6.33 6,88 10,84 R19.P$2
R4
  Top 0.152: R18.P$2 10,81 8,83 8,85 6.25,86.75 4.5,86.75 4.5,89.25 3.25,90.5 U$6.36
R5
  Top 0.152: U$6.35 6,90.5 9.5,87 10,87 R17.P$2
R6
  Top 0.152: U$6.38 3,93.25 2,94.25 2,96.25 3.75,98 11.5,98 11.5,91.25 10.25,90 R8.P$2
R7
  Top 0.152: U$6.37 6,93 10,93 R7.P$2
R8
  Top 0.152: U$6.40 3.25,95.75 4.5,97 10,97 10,96 R6.P$2
SERVO_BASKET  (via drill 0.35)
  Top 0.152: U$1.PB0 24.75,32.25 28.5,36 28.5,42.75 35,49.25 72.5,49.25 72.5,47.25 74.75,45 74.75,38 69.25,32.5 69.25,30.5 69.5,30.25 69.5,27.75 v69.75,27.5 69.75,25 75.5,25 v77,26.5
  Bottom 0.152: v69.75,27.5 71.25,29 71.75,29 R12.P$1 | v77,26.5 81.75,21.75 M3.1
SERVO_CLAW_1  (via drill 0.35)
  Top 0.152: v81.25,32.25 80.75,32.75 80.75,38 81,38.25 81,55.5 82.75,57.25 U$1.PA6 | M2.1 73.5,21.75 78.5,26.75 79,26.75 R11.P$1
  Bottom 0.152: v81.25,32.25 81.25,28.75 79.25,26.75 R11.P$1
SERVO_CLAW_2  (via drill 0.35)
  Top 0.152: v80.25,53.25 80.5,53 80.5,44.5 v80.25,44.25 | v79.25,43.25 78.75,42.75 78.75,32 R9.P$1 78.5,31.75 78.5,31.5 v74.75,27.75
  Bottom 0.152: v80.25,53.25 81.75,54.75 82.75,54.75 U$1.PA7 | v79.25,43.25 v80.25,44.25 | v74.75,27.75 72,25 68,25 64.75,21.75 M1.1
STM_RX  (via drill 0.35)
  Top 0.152: v61,64 66.5,58.5 66.5,57.75 78.75,57.75 79.75,58.75 83.5,58.75 84.25,58 84.25,51.25 83,50 U$1.PC7 | v60,65 55.75,65 46.75,74 20,74 20,68.5 15.25,63.75 7,63.75 7,57 6.25,56.25 3.25,56.25 3.25,55.25 U$6.8
  Bottom 0.152: v60,65 v61,64
STM_SUPPLY  (via drill 0.35)
  Top 0.152: v40,82.25 54.25,96.5 54.25,97.5 55.5,98.75 69.5,98.75 69.5,103 71.25,104.75 STM_FUSE.P$1
  Bottom 0.152: v40,82.25 25.5,67.75 24.75,67.75 U$1.E5V
STM_TX  (via drill 0.35)
  Top 0.152: v40,75.25 v85.25,75.25 | v38.5,76.75 19.5,76.75 19.5,68.75 18.5,67.75 7,67.75 7,68.25 6.25,69 4.5,69 4.5,59 3.25,57.75 U$6.10
  Bottom 0.152: v85.25,75.25 87,73.5 87,71.75 85.5,70.25 U$1.PC6 | v38.5,76.75 v40,75.25
TAPE_LEFT
  Bottom 0.152: IC4.7 45.75,10.25 45.75,11 49,14.25 52.25,14.25 55,17 57.75,17 68.5,27.75 69,27.75 70,28.75 70,29.5 71,30.5 72,30.5 80,38.5 84,38.5 85,39.5 85.5,39.5 U$1.PB14
TAPE_RIGHT  (via drill 0.35)
  Top 0.152: v81.5,37.75 81.75,38 81.75,40.25 82.5,41 84.75,41 84.75,41.5 U$1.PB15
  Bottom 0.152: v81.5,37.75 76.75,33 76.75,28.75 71.25,23.25 71.25,16.75 IC5.7
TLA  (via drill 0.35)
  Top 0.152: IC4.3 48.25,2.5 49.5,3.75 52.5,3.75 52.5,3.25 53,2.75 53,2.5 R13.P$1 53.25,2.25 53.25,2 57.25,2 59,3.75 U3.1 | v40.75,9.25 32.25,9.25 28.25,13.25 28.25,19.75 23.25,24.75 23.25,28.25 22,29.5 U$1.PC2
  Bottom 0.152: v40.75,9.25 47.5,2.5 48,2.5 IC4.3
TRA
  Top 0.152: IC5.3 73.75,9 76,11.25 84.5,11.25 U4.1 84.75,11.5 86.25,13 86.25,17.5 | 86.25,17.5 86.75,17.5 86.75,17 R16.P$1 86.25,17.5 | 86.25,17.5 83.5,17.5 80.25,20.75 80.25,23.25 83.75,23.25 87,26.5 87,30.5 85.5,32 U$1.PC4
V_IN1
  Top 0.152: 33.75,13 33.75,11.25 C2.1 | 33.75,13 33.75,14 | 33.75,14 33.75,14.75 34.75,15.75 U$4.1 | 33.75,14 30,14 LIPO_SMALL_1.2 | 33.75,13 39.25,13 D1.C